# EasyEDA schematic SCH_LPL_ESP32signalhacker_2023-05-05.json
TITLE: Simple LPLT; REV: 1.0; Date: 2022-09-15; Sheet: 1/1; Drawn By: maarnotto; Company: Your Company
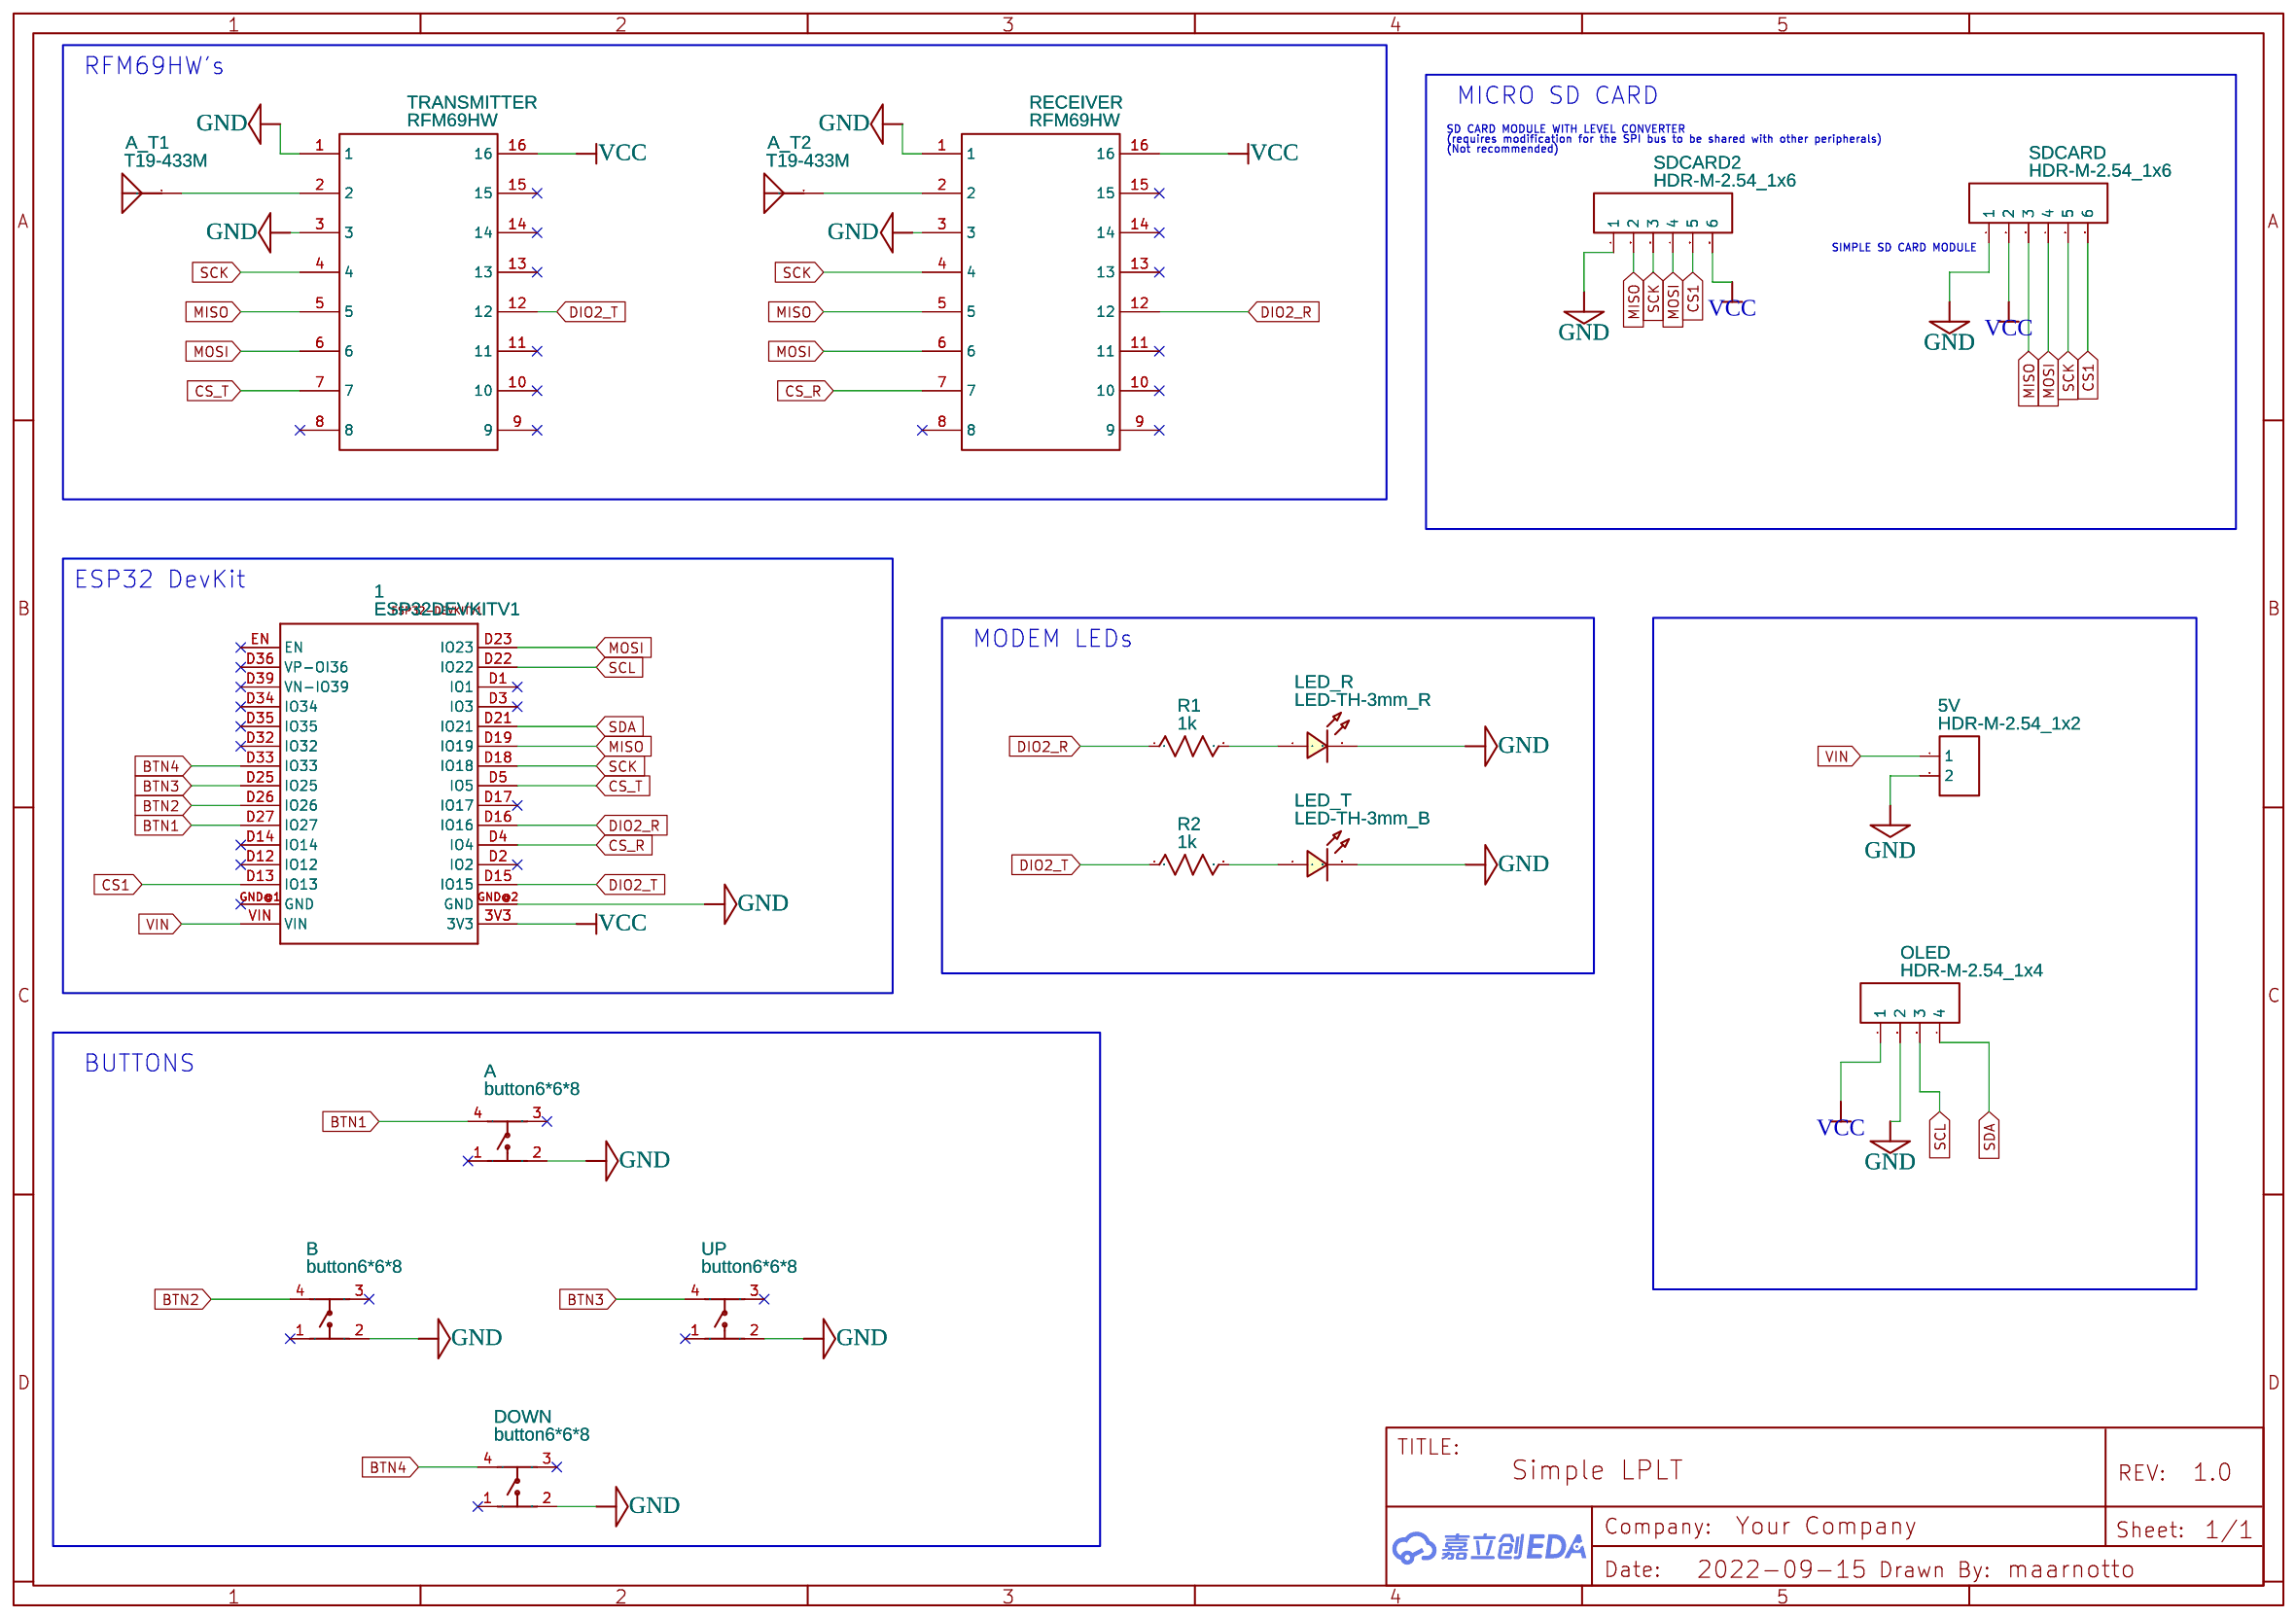
[diagram p0: schematic sheet]

## Parts
1  ESP32DEVKITV1  [ESP32-DEVKITV1]
5V  HDR-M-2.54_1x2  [HDR-M-2.54_1X2]
A  button6*6*8  [KEY-TH_4P-L6.0-W6.0-P4.50-LS7.5]
A_T1  T19-433M  [ANT-TH_T19-433M]
A_T2  T19-433M  [ANT-TH_T19-433M]
B  button6*6*8  [KEY-TH_4P-L6.0-W6.0-P4.50-LS7.5]
DOWN  button6*6*8  [KEY-TH_4P-L6.0-W6.0-P4.50-LS7.5]
LED_R  LED-TH-3mm_R  [LED-TH_BD3.0_RED]
LED_T  LED-TH-3mm_B  [LED-TH_BD3.0_BLUE]
OLED  HDR-M-2.54_1x4  [HDR-M-2.54_1X4]
R1  1k  [R_AXIAL-0.3]
R2  1k  [R_AXIAL-0.3]
RECEIVER  RFM69HW  [RFM69HW]
SDCARD  HDR-M-2.54_1x6  [HDR-M-2.54_1X6]
SDCARD2  HDR-M-2.54_1x6  [HDR-M-2.54_1X6]
TRANSMITTER  RFM69HW  [RFM69HW]
UP  button6*6*8  [KEY-TH_4P-L6.0-W6.0-P4.50-LS7.5]

## Library data of the parts
1 = ESP32DEVKITV1: Contributor: UO250789
5V = HDR-M-2.54_1x2: Supplier Part: C124375; Supplier: LCSC; Contributor: LCEDA_Lib
A B DOWN UP = button6*6*8: Supplier Part: C59982; Supplier: LCSC; Manufacturer: ReliaPro; JLCPCB Part Class: Extended Part
A_T1 A_T2 = T19-433M: Supplier: LCSC; Supplier Part: C403733; Manufacturer: DreamLNK(骏晔科技); Contributor: LCSC; JLCPCB Part Class: Extended Part
LED_R = LED-TH-3mm_R: Manufacturer: EVERLIGHT(台湾亿光); Manufacturer Part: 204-10SDRD/S530-A3-L; Supplier Part: C84774; Supplier: LCSC; Contributor: LCEDA_Lib
LED_T = LED-TH-3mm_B: Manufacturer: EVERLIGHT(台湾亿光); Manufacturer Part: 204-10SUBC/S400-A4; Supplier Part: C86881; Supplier: LCSC; Contributor: LCEDA_Lib
OLED = HDR-M-2.54_1x4: Supplier Part: C124378; Supplier: LCSC; Contributor: LCEDA_Lib
R1 R2 = R_AXIAL-0.3_US: Contributor: LCEDA_Lib
RECEIVER TRANSMITTER = RFM69HW: Contributor: rafal9318
SDCARD SDCARD2 = HDR-M-2.54_1x6: Supplier Part: C190819; Supplier: LCSC; Contributor: LCEDA_Lib

## Nets
GND: 1.GND@2(GND) 5V.2 A.2 B.2 DOWN.2 LED_R.2 LED_T.2 OLED.2 RECEIVER.1 RECEIVER.3 SDCARD.1 SDCARD2.1 TRANSMITTER.1 TRANSMITTER.3 UP.2
VCC: 1.3V3 OLED.1 RECEIVER.16 SDCARD.2 SDCARD2.6 TRANSMITTER.16
VIN: 1.VIN 5V.1
BTN1: 1.D27(IO27) A.4
BTN2: 1.D26(IO26) B.4
BTN3: 1.D25(IO25) UP.4
BTN4: 1.D33(IO33) DOWN.4
CS1: 1.D13(IO13) SDCARD.6 SDCARD2.5
CS_R: 1.D4(IO4) RECEIVER.7
CS_T: 1.D5(IO5) TRANSMITTER.7
DIO2_R: 1.D16(IO16) R1.1 RECEIVER.12
DIO2_T: 1.D15(IO15) R2.1 TRANSMITTER.12
MISO: 1.D19(IO19) RECEIVER.5 SDCARD.3 SDCARD2.2 TRANSMITTER.5
MOSI: 1.D23(IO23) RECEIVER.6 SDCARD.4 SDCARD2.4 TRANSMITTER.6
SCK: 1.D18(IO18) RECEIVER.4 SDCARD.5 SDCARD2.3 TRANSMITTER.4
SCL: 1.D22(IO22) OLED.3
SDA: 1.D21(IO21) OLED.4
Net-(A_T1-1): A_T1.1 TRANSMITTER.2
Net-(A_T2-1): A_T2.1 RECEIVER.2
Net-(LED_R-1): LED_R.1 R1.2
Net-(LED_T-1): LED_T.1 R2.2

Not connected (* = marked no-connect by the designer): 1 D1(IO1)* D2(IO2)* D3(IO3)* D12(IO12)* D14(IO14)* D17(IO17)* D32(IO32)* D34(IO34)* D35(IO35)* D36(VP-OI36)* D39(VN-IO39)* EN* GND@1(GND)*; A 1* 3*; B 1* 3*; DOWN 1* 3*; RECEIVER 8* 9* 10* 11* 13* 14* 15*; TRANSMITTER 8* 9* 10* 11* 13* 14* 15*; UP 1* 3*

## Notes on the sheet
- RFM69HW's
- MICRO SD CARD
- (requires modification for the SPI bus to be shared with other peripherals)
- SD CARD MODULE WITH LEVEL CONVERTER
- (Not recommended)
- SIMPLE SD CARD MODULE
- ESP32 DevKit
- MODEM LEDs
- BUTTONS
